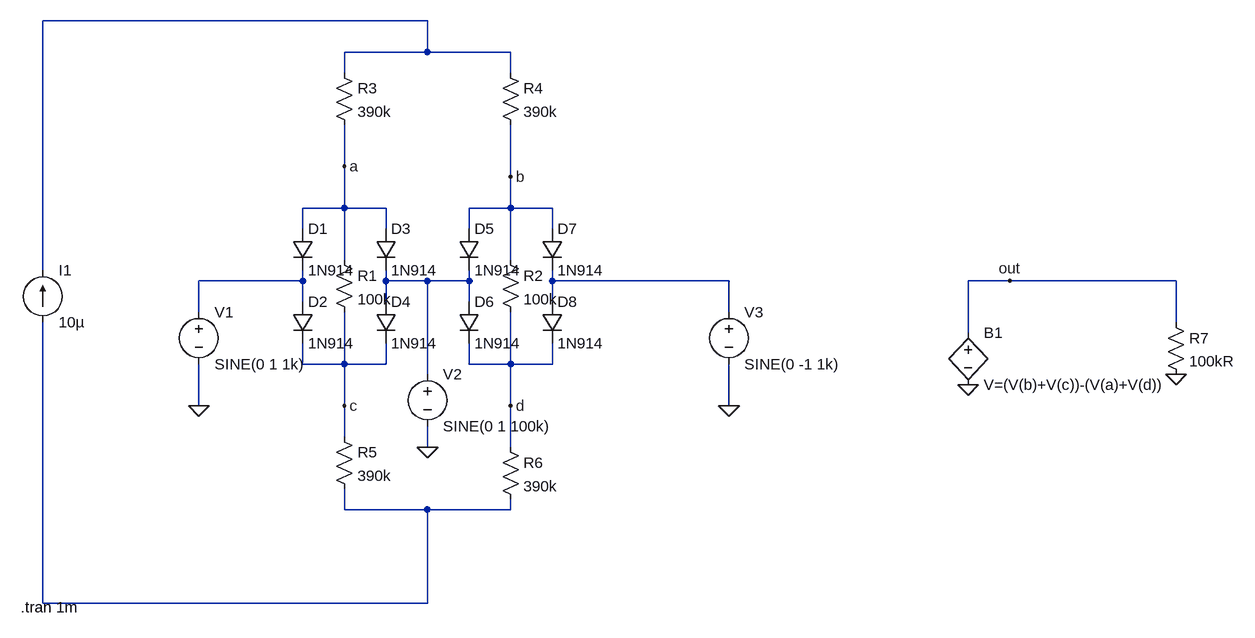
[diagram p0: schematic bridge_mult.asc]
bridge_mult.asc, the LTspice schematic file:
Version 4
SHEET 1 1512 696
WIRE 256 -224 -336 -224
WIRE 256 -176 256 -224
WIRE 256 -176 128 -176
WIRE 384 -176 256 -176
WIRE 128 -144 128 -176
WIRE 384 -144 384 -176
WIRE 128 0 128 -64
WIRE 384 16 384 -64
WIRE 128 64 128 0
WIRE 128 64 64 64
WIRE 192 64 128 64
WIRE 384 64 384 16
WIRE 384 64 320 64
WIRE 448 64 384 64
WIRE 64 96 64 64
WIRE 192 96 192 64
WIRE 320 96 320 64
WIRE 448 96 448 64
WIRE 128 144 128 64
WIRE 384 144 384 64
WIRE -336 160 -336 -224
WIRE 64 176 64 160
WIRE 64 176 -96 176
WIRE 192 176 192 160
WIRE 256 176 192 176
WIRE 320 176 320 160
WIRE 320 176 256 176
WIRE 448 176 448 160
WIRE 720 176 448 176
WIRE 1152 176 1088 176
WIRE 1408 176 1152 176
WIRE 64 208 64 176
WIRE 192 208 192 176
WIRE 320 208 320 176
WIRE 448 208 448 176
WIRE -96 224 -96 176
WIRE 720 224 720 176
WIRE 1408 240 1408 176
WIRE 1088 256 1088 176
WIRE 64 304 64 272
WIRE 128 304 128 224
WIRE 128 304 64 304
WIRE 192 304 192 272
WIRE 192 304 128 304
WIRE 320 304 320 272
WIRE 384 304 384 224
WIRE 384 304 320 304
WIRE 448 304 448 272
WIRE 448 304 384 304
WIRE 256 320 256 176
WIRE -96 368 -96 304
WIRE 128 368 128 304
WIRE 384 368 384 304
WIRE 720 368 720 304
WIRE 128 416 128 368
WIRE 256 432 256 400
WIRE 384 432 384 368
WIRE 128 528 128 496
WIRE 256 528 128 528
WIRE 384 528 384 512
WIRE 384 528 256 528
WIRE -336 672 -336 240
WIRE 256 672 256 528
WIRE 256 672 -336 672
FLAG 256 432 0
FLAG 128 0 a
FLAG 384 16 b
FLAG 128 368 c
FLAG 384 368 d
FLAG -96 368 0
FLAG 720 368 0
FLAG 1088 336 0
FLAG 1408 320 0
FLAG 1152 176 out
SYMBOL diode 48 96 R0
SYMATTR InstName D1
SYMATTR Value 1N914
SYMATTR Description Schottky diode
SYMATTR Type schottky
SYMBOL diode 48 208 R0
SYMATTR InstName D2
SYMATTR Value 1N914
SYMATTR Description Schottky diode
SYMATTR Type schottky
SYMBOL diode 176 96 R0
SYMATTR InstName D3
SYMATTR Value 1N914
SYMATTR Description Schottky diode
SYMATTR Type schottky
SYMBOL diode 176 208 R0
SYMATTR InstName D4
SYMATTR Value 1N914
SYMATTR Description Schottky diode
SYMATTR Type schottky
SYMBOL diode 304 96 R0
SYMATTR InstName D5
SYMATTR Value 1N914
SYMATTR Description Schottky diode
SYMATTR Type schottky
SYMBOL diode 304 208 R0
SYMATTR InstName D6
SYMATTR Value 1N914
SYMATTR Description Schottky diode
SYMATTR Type schottky
SYMBOL diode 432 96 R0
SYMATTR InstName D7
SYMATTR Value 1N914
SYMATTR Description Schottky diode
SYMATTR Type schottky
SYMBOL diode 432 208 R0
SYMATTR InstName D8
SYMATTR Value 1N914
SYMATTR Description Schottky diode
SYMATTR Type schottky
SYMBOL res 112 128 R0
SYMATTR InstName R1
SYMATTR Value 100k
SYMBOL res 368 128 R0
SYMATTR InstName R2
SYMATTR Value 100k
SYMBOL res 112 -160 R0
SYMATTR InstName R3
SYMATTR Value 390k
SYMBOL res 368 -160 R0
SYMATTR InstName R4
SYMATTR Value 390k
SYMBOL res 112 400 R0
SYMATTR InstName R5
SYMATTR Value 390k
SYMBOL res 368 416 R0
SYMATTR InstName R6
SYMATTR Value 390k
SYMBOL voltage -96 208 R0
WINDOW 123 0 0 Left 2
WINDOW 39 0 0 Left 2
SYMATTR InstName V1
SYMATTR Value SINE(0 1 1k)
SYMBOL voltage 256 304 R0
WINDOW 123 0 0 Left 2
WINDOW 39 0 0 Left 2
SYMATTR InstName V2
SYMATTR Value SINE(0 1 100k)
SYMBOL current -336 240 M180
WINDOW 0 24 80 Left 2
WINDOW 3 24 0 Left 2
WINDOW 123 0 0 Left 2
WINDOW 39 0 0 Left 2
SYMATTR InstName I1
SYMATTR Value 10µ
SYMBOL voltage 720 208 R0
WINDOW 123 0 0 Left 2
WINDOW 39 0 0 Left 2
SYMATTR InstName V3
SYMATTR Value SINE(0 -1 1k)
SYMBOL res 1392 224 R0
SYMATTR InstName R7
SYMATTR Value 100kR
SYMBOL bv 1088 240 R0
SYMATTR InstName B1
SYMATTR Value V=(V(b)+V(c))-(V(a)+V(d))
TEXT -370 678 Left 2 !.tran 1m

The netlist it stands for:
* bridge_mult.asc
D1 a N002 1N914
D2 N002 c 1N914
D3 a N003 1N914
D4 N003 c 1N914
D5 b N003 1N914
D6 N003 d 1N914
D7 b N004 1N914
D8 N004 d 1N914
R1 a c 100k
R2 b d 100k
R3 N001 a 390k
R4 N001 b 390k
R5 c N005 390k
R6 d N005 390k
V1 N002 0 SINE(0 1 1k)
V2 N003 0 SINE(0 1 100k)
I1 N005 N001 10µ
V3 N004 0 SINE(0 -1 1k)
R7 out 0 100kR
B1 out 0 V=(V(b)+V(c))-(V(a)+V(d))
.model D D
.lib standard.dio
.tran 1m
.backanno
.end